# Altium schematic sheet Wire Detector Schematics.SchDoc
size A4; SheetNumber: 1; SheetTotal: 1
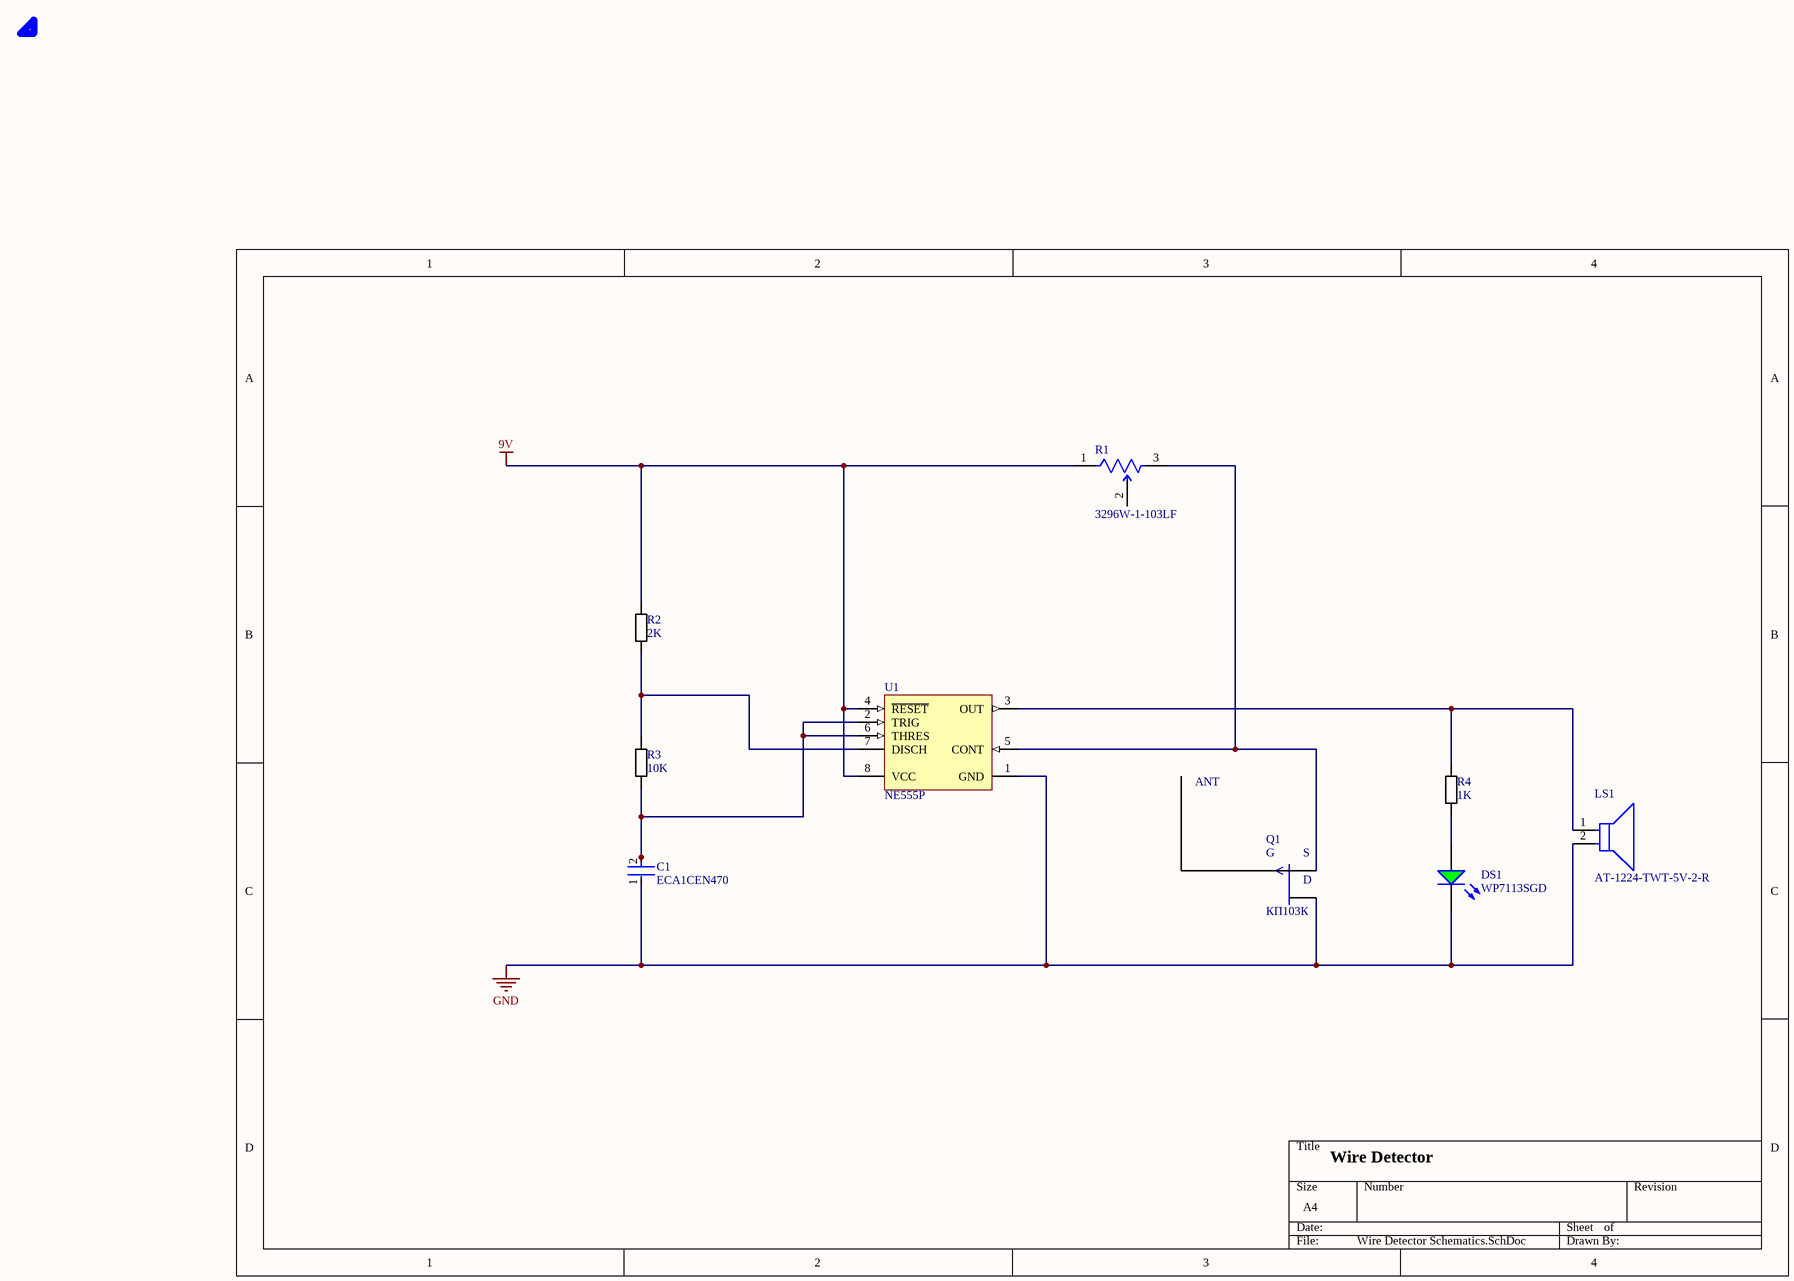
[diagram p0: Wire Detector Schematics.SchDoc]

## Parts
C1  ECA1CEN470  [FP-RAD-TH-D_6_3_0_5-L_11-MFG]
DS1  WP7113SGD  [KING-WP7113SGD_V]
LS1  AT-1224-TWT-5V-2-R  [FP-AT-1224-TWT-5V-2-R-MFG]
Q1  КП103К  [TO127P584H533-3]
R1  3296W-1-103LF  [FP-3296W-MFG]
R2  2K  [R]
R3  10K  [R]
R4  1K  [R]
U1  NE555P  [P0008A]

## Nets
9V: R1.1(CCW) R2.2 U1.4(~{RESET}) U1.8(VCC)
GND: C1.1 DS1.2(K) LS1.2(A) Q1.3(D) U1.1(GND)
NetC1_2: C1.2 R3.1 U1.2(TRIG) U1.6(THRES)
NetDS1_1: DS1.1(A) R4.1
NetLS1_1: LS1.1(C) R4.2 U1.3(OUT)
NetQ1_1: Q1.1(S) R1.3(CW) U1.5(CONT)
NetR2_1: R2.1 R3.2 U1.7(DISCH)

Not connected (* = marked no-connect by the designer): Q1 2(G); R1 2(WIPER)

## Notes on the sheet
- ANT
- Wire Detector

## Library data of the parts
C1 = CMP-05427-001931-1: Aluminum Electrolytic Capacitors (Radial Lead Type) 47uF ±20% 16V; Ripple Current: 100mA; Lead/Base Style: Straight; Case/Package: Radial; Series: GA; Package Quantity: 200; Termination: Radial; Capacitance: 47uF; Packaging: Ammo Pack; Tolerance: 20%; Voltage Rating (DC): 16V; Min Operating Temperature: -40°C; RoHS Compliant: Yes; Max Operating Temperature: 105°C; Mount: Through Hole; Lead Pitch: 2.5mm
DS1 = CMP-2100-03698-1: LED Green, 62.5 mW, 25 mA, -40 to 85 degC, 2-Pin THD, RoHS, Bulk; Manufacturer: Kingbright; Viewing Angle: 30degrees; Lens Style: Tinted; Test Current: 20mA; Forward Voltage: 2.2V; Wavelength: 568nm; Luminous Intensity: 40mcd; Package Reference: WP7113SGD; Colour: Green; Lead Free: LeadFree; Packaging: Bulk; RoHSCompliant: true; Package Quantity: 1000; Illumination Colour: Green; Case/Package: Radial; Datasheet URL: http://www.kingbrightusa.com/images/catalog/SPEC/WP7113SGD.pdf; Dominant Wavelength: 568nm; Datasheet Version: Rev. 6B, 01/2015; Package Description: 2-Pin Through Hole Device, Dia 5.9 mm, Body Length 8.6 mm; Height: 8.6mm
LS1 = CMP-231722-000001-1: BUZZER MAGNETIC 5V 12MM TH; Operating Supply Current: 40mA; Frequency: 2.4kHz; Min Operating Temperature: -30°C; Voltage Rating: 5V; Mount: Through Hole; Diameter: 12mm; Termination: PC Pins; Max Operating Temperature: 70°C; Contact Plating: Tin; Height: 9mm; Series: AT; Max Supply Current: 40mA; Sensing Method: Magnetic; Packaging: Tray
Q1 = 2N2608: JFET P-Channel 10V 0.038W Through Hole TO-18; MF: Motorola; SnapEDA_Link: https://www.snapeda.com/parts/2N2608/Motorola/view-part/?ref=snap; Package: TO-18 Motorola; Value: *; MP: 2N2608; Check_prices: https://www.snapeda.com/parts/2N2608/Motorola/view-part/?ref=eda
R1 = CMP-1747-00001-8: TRIMMER 10K OHM 0.5W PC PIN TOP; Number of Turns: 25; Tolerance: 10%; Resistance: 10kR; Max Power Dissipation: 500mW; Temperature Coefficient: 100ppm/°C; Insulation Resistance: 1GR; Min Operating Temperature: -55°C; Resistor Type: Cermet; Series: 3296; Color: Blue; Mount: Through Hole; Taper: Linear; Radiation Hardening: No; RoHS Compliant: Yes; Width: 9.53mm; Resistance Tolerance: 10%; Contact Plating: Tin; Military Standard: Not; Package Quantity: 50; Weight: 0.03oz; Lead Free: Lead Free; Power Rating: 500mW; Termination: Pin; Technology: CERMET; Max Operating Temperature: 125°C; Packaging: Rail/Tube; Length: 9.53mm; Depth: 4.83mm; Height: 11.55mm; Reach SVHC Compliant: Yes
R2-R4 = R 0,250W: 1 kOhms ±1% 0.25W, 1/4W Through Hole Resistor Axial Automotive AEC-Q200 Metal Film; MPN: MFS1/4CC1001F; Voltage: 250V; SPN#1: 2019-MFS1/4CC1001F-ND; Supplier #1: DigiKey; ComponentLink1Description: Datasheet; ComponentLink1URL: https://www.koaspeer.com/pdfs/MF-MFS-RK.pdf; ComponentLink2Description: Supplier #1; ComponentLink2URL: https://www.digikey.pl/en/products/detail/koa-speer-electronics-inc/MFS1-4CC1001F/21681477
  R2: Value: 2K
  R3: Value: 10K
  R4: Value: 1K
U1 = CMP-2000-04954-1: Precision Timer, 4.5 to 16 V, 0 to 70 degC, 8-Pin DIP, Pb-Free, Tube; Manufacturer: TexasInstruments; Maximum High Level Output Current: -200mA; Number of Internal Timers: 1; Operating Supply Voltage: 5; Maximum Low Level Output Current: 200mA; Rad Hard: No; Packaging: Rail/Tube; Manufacturer URL: http://www.ti.com/; Package Reference: P8; Package Description: 8-Pin Double In-line Package, Body 9.59 x 6.35 mm, Pitch 2.54 mm; Package URL: http://www.ti.com/lit/ml/mpdi001b/mpdi001b.pdf; Type: Standard; Datasheet URL: http://www.ti.com/general/docs/lit/getliterature.tsp?genericPartNumber=NE555&fileType=pdf; Category: Timer; Package: 8PDIP; Datasheet Version: Rev. I, 09/2014